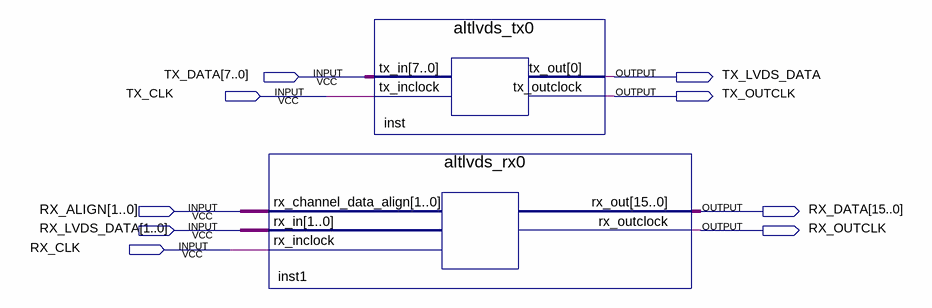
[diagram p0: schematic sheet]
// Quartus schematic cc_lvds_tranceivers.bdf as structural Verilog: 2 symbols, 9 pins
module cc_lvds_tranceivers (
  input  [7:0] TX_DATA,
  input  TX_CLK,
  input  [1:0] RX_ALIGN,
  input  [1:0] RX_LVDS_DATA,
  input  RX_CLK,
  output TX_LVDS_DATA,
  output TX_OUTCLK,
  output [15:0] RX_DATA,
  output RX_OUTCLK
);

  altlvds_rx0 inst1 (
    .rx_channel_data_align(RX_ALIGN), .rx_in(RX_LVDS_DATA), .rx_inclock(RX_CLK), .rx_out(RX_DATA),
    .rx_outclock(RX_OUTCLK));
  altlvds_tx0 inst (.tx_in(TX_DATA), .tx_inclock(TX_CLK), .tx_out(TX_LVDS_DATA), .tx_outclock(TX_OUTCLK));
endmodule
